# Altium project PCB_Project_STM32_F103.PrjPcb
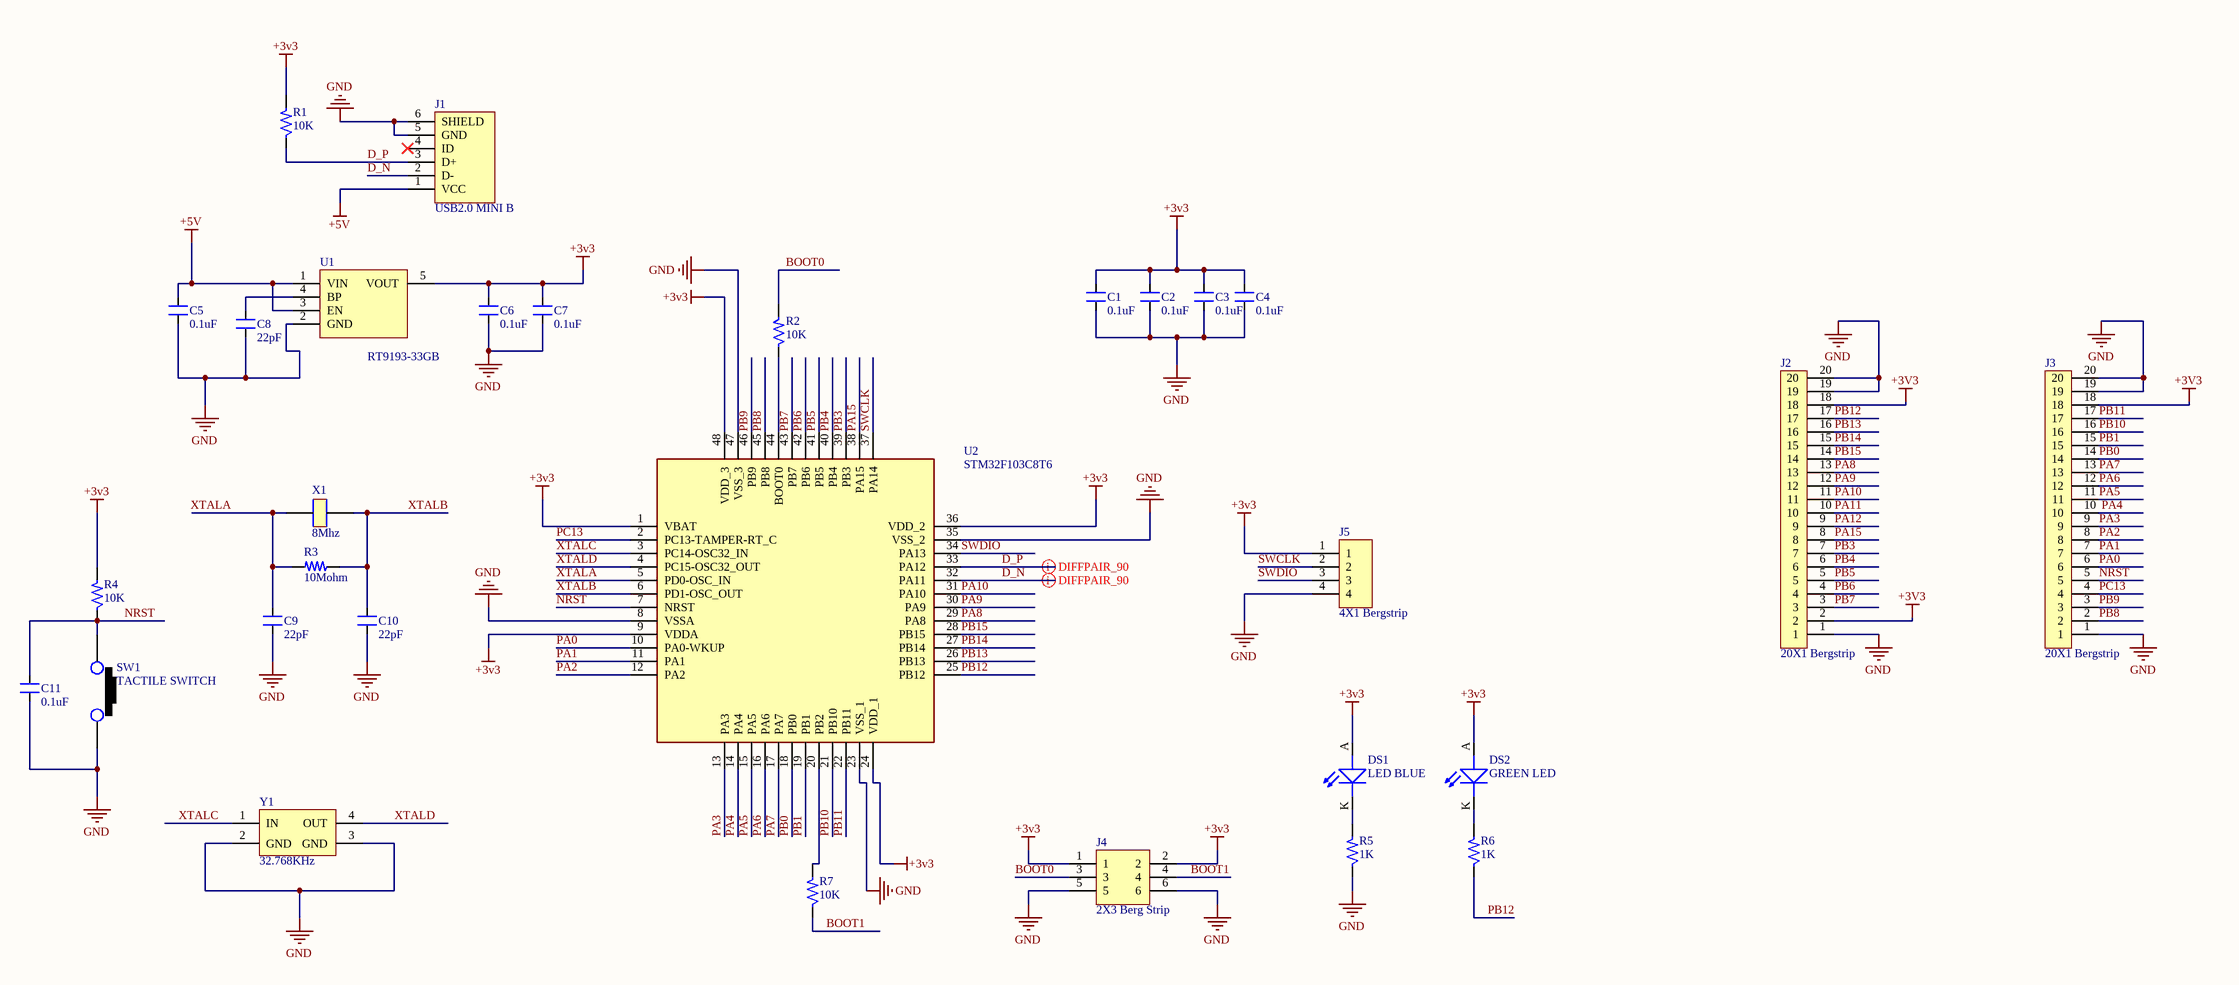
[diagram p0: stm32f103.SchDoc]
1 sheet, 30 parts. Net scope: global (net labels, ports and power ports of the same name join across sheets).
Board file: PCB1.~(37).PcbDoc

## Sheet stm32f103.SchDoc
size C; SheetNumber: 1; SheetTotal: 1

### Parts
C1  0.1uF  [CAP_0805]
C2  0.1uF  [CAP_0805]
C3  0.1uF  [CAP_0805]
C4  0.1uF  [CAP_0805]
C5  0.1uF  [CAP_0805]
C6  0.1uF  [CAP_0805]
C7  0.1uF  [CAP_0805]
C8  22pF  [CAP_0805]
C9  22pF  [CAP_0805]
C10  22pF  [CAP_0805]
C11  0.1uF  [CAP_0805]
DS1  LED BLUE  [LED_0805]
DS2  GREEN LED  [LED_0805]
J1  USB2.0 MINI B  [CON_690-005-299-043]
J2  20X1 Bergstrip  [CON20_100_40D72_TH_ST]
J3  20X1 Bergstrip  [CON20_100_40D72_TH_ST]
J4  2X3 Berg Strip  [CON6_100_59D78_TH_ST_Duplicate]
J5  4X1 Bergstrip  [CON4_100_40D72_TH_ST_MALE]
R1  10K  [RES_0805]
R2  10K  [RES_0805]
R3  10Mohm  [RES_0805]
R4  10K  [RES_0805]
R5  1K  [RES_0805]
R6  1K  [RES_0805]
R7  10K  [RES_0805]
SW1  TACTILE SWITCH  [SW_342_SMD]
U1  RT9193-33GB  [SOT23-5]
U2  STM32F103C8T6  [LQFP-48_19.6_393_58X11_SMD]
X1  8Mhz  [XTAL_314_240X47_SMD]
Y1  32.768KHz  [XTAL_MC-405 32.7680K-G3]

### Nets
+3v3: C1.2 C2.2 C3.2 C4.2 C6.2 C7.2 DS1.A(ANODE) DS2.A(ANODE) J2.2 J2.18 J3.18 J4.1 J4.2 J5.1 R1.2 R4.2 U1.5(VOUT) U2.1(VBAT) U2.9(VDDA) U2.24(VDD_1) U2.36(VDD_2) U2.48(VDD_3)
+5V: C5.2 J1.1(VCC) U1.1(VIN) U1.3(EN)
GND: C1.1 C2.1 C3.1 C4.1 C5.1 C6.1 C7.1 C8.1 C9.1 C10.1 C11.1 J1.5(GND) J1.6(SHIELD) J2.1 J2.19 J2.20 J3.1 J3.19 J3.20 J4.5 J4.6 J5.4 R5.1 SW1.2 U1.2(GND) U2.8(VSSA) U2.23(VSS_1) U2.35(VSS_2) U2.47(VSS_3) Y1.2(GND) Y1.3(GND)
BOOT0: J4.3 R2.2
BOOT1: J4.4 R7.1
D_N: J1.2(D-) U2.32(PA11)
D_P: J1.3(D+) R1.1 U2.33(PA12)
NRST: C11.2 J3.5 R4.1 SW1.1 U2.7(NRST)
PA0: J3.6 U2.10(PA0-WKUP)
PA1: J3.7 U2.11(PA1)
PA2: J3.8 U2.12(PA2)
PA3: J3.9 U2.13(PA3)
PA4: J3.10 U2.14(PA4)
PA5: J3.11 U2.15(PA5)
PA6: J3.12 U2.16(PA6)
PA7: J3.13 U2.17(PA7)
PA8: J2.13 U2.29(PA8)
PA9: J2.12 U2.30(PA9)
PA10: J2.11 U2.31(PA10)
PA11: J2.10
PA12: J2.9
PA15: J2.8 U2.38(PA15)
PB0: J3.14 U2.18(PB0)
PB1: J3.15 U2.19(PB1)
PB3: J2.7 U2.39(PB3)
PB4: J2.6 U2.40(PB4)
PB5: J2.5 U2.41(PB5)
PB6: J2.4 U2.42(PB6)
PB7: J2.3 U2.43(PB7)
PB8: J3.2 U2.45(PB8)
PB9: J3.3 U2.46(PB9)
PB10: J3.16 U2.21(PB10)
PB11: J3.17 U2.22(PB11)
PB12: J2.17 R6.1 U2.25(PB12)
PB13: J2.16 U2.26(PB13)
PB14: J2.15 U2.27(PB14)
PB15: J2.14 U2.28(PB15)
PC13: J3.4 U2.2(PC13-TAMPER-RT_C)
SWCLK: J5.2 U2.37(PA14)
SWDIO: J5.3 U2.34(PA13)
XTALA: C9.2 R3.1 U2.5(PD0-OSC_IN) X1.1
XTALB: C10.2 R3.2 U2.6(PD1-OSC_OUT) X1.2
XTALC: U2.3(PC14-OSC32_IN) Y1.1(IN)
XTALD: U2.4(PC15-OSC32_OUT) Y1.4(OUT)
NetC8_2: C8.2 U1.4(BP)
NetDS1_K: DS1.K(CATHODE) R5.2
NetDS2_K: DS2.K(CATHODE) R6.2
NetR2_1: R2.1 U2.44(BOOT0)
NetR7_2: R7.2 U2.20(PB2)

Not connected (* = marked no-connect by the designer): J1 4(ID)*

### Layout directives
differential pair; differential pair class diff_90: D_N, D_P

### Library data of the parts
C1-C7 C11 = CAP_0.1uF-50V-5%-0805: 0.1µF ±5% 50V Ceramic Capacitor X7R 0805 (2012 Metric); Manufacturer: AVX Corporation; Manufacturer Part Number: 08055C104JAT4A; Alternate Part Number-1: 0805B104M500; Case/Package: 0805; Supplier-1: SIRICOM; Supplier Part Number-1: 0805B104J500CT
C8-C10 = CAP_22PF-50V-5%-0805: 22pF ±5% 50V Ceramic Capacitor C0G, NP0 0805 (2012 Metric); Manufacturer: Yageo; Manufacturer Part Number: CC0805JRNPO9BN220; Alternate Part Number-1: 0805CG220J500NT; Case/Package: 0805; Supplier-1: SIRICOM; Supplier Part Number-1: 0805N220J500CT
DS1 = LED_BLUE-3V3-20mA-0805: Blue 470nm LED Indication - Discrete 3.3V 0805 (2012 Metric); Manufacturer: Vishay Lite-On; Manufacturer Part Number: LTST-C171TBKT; Alternate Part Number-1: NA; Case/Package: 0805; Supplier-1: SP ROAD; Supplier Part Number-1: LTST-C171TBKT
DS2 = LED_GREEN-2.2-20mA-0805: Green 569nm LED Indication - Discrete 2.1V 0805 (2012 Metric); Manufacturer: Vishay Lite-On; Manufacturer Part Number: LTST-C171GKT; Alternate Part Number-1: NA; Case/Package: 0805; Supplier-1: SP ROAD; Supplier Part Number-1: LTST-C171GKT
J1 = CON_USB2.0-MINIB-SMD: USB - mini B USB 2.0 Receptacle Connector 5 Position Surface Mount, Right Angle; Manufacturer: EDAC; Manufacturer Part Number: 690-005-299-043; Alternate Part Number-1: NA; Case/Package: USB-MINI-B; Supplier-1: LCSC; Supplier Part Number-1: C105424
J2 J3 = CON-BS-PLG_20X1-100-TH-ST: 20 pin, 1 row, 2.54mm pitch bergstrip; Manufacturer: NA; Manufacturing Part Number: NA; Case/Package: TH; Supplier-1: NA; Supplier Part Number-1: NA
J4 = CON-BS-PLG_2X3-100-TH-ST: 6 pin, 2 row, 2.54mm pitch bergstrip; Manufacturer: NA; Manufacturer Part Number: NA; Case/Package: TH; Supplier-1: NA; Supplier Part Number-1: NA
J5 = CON-BS-PLG_4X1-100-TH-ST: 4 pin, 1 row, 2.54mm pitch bergstrip; Manufacturer: NA; Manufacturing Part Number: NA; Case/Package: TH; Supplier-1: NA; Supplier Part Number-1: NA
R1 R2 R4 R7 = RES_10K-0.125W-1%-0805: 10 kOhms ±1% 0.125W, 1/8W Chip Resistor 0805 (2012 Metric) Automotive AEC-Q200 Thick Film; Manufacturer: CTS; Manufacturer Part Number: WR08X1002FTL; Case/Package: 0805; Supplier-1: SIRICOM; Supplier Part Number-1: WR08X1002FTL; Alternate Part Number-1: WR08X1002FTL
R3 = RES_10MOHM-0.125W-1%-0805: 10 MOhms ±1% 0.125W, 1/8W Chip Resistor 0805 (2012 Metric) Automotive AEC-Q200, High Voltage Thick Film; Manufacturer: Rohm Semiconductor; Manufacturing Part Number: KTR10EZPF1005; Case/Package: 0805 (2012 Metric); Supplier-1: Digikey; Supplier Part Number-1: RHM10.0MAHCT-ND
R5 R6 = RES_1K-0.125W-1%-0805: 1 kOhms ±1% 0.125W, 1/8W Chip Resistor 0805 (2012 Metric) Moisture Resistant Thick Film; Manufacturer: Walsin; Manufacturer Part Number: WR08X1001FTL; Case/Package: 0805; Supplier-1: SP ROAD; Supplier Part Number-1: RC0805JR-071KL; Alternate Part Number-1: WR08X1001FTL
SW1 = SW1_RS-282G05A3-SMRT-SMD: Tactile Switch SPST-NO Top Actuated Surface Mount; Manufacturer: ITT C&K; Alternate Part Number-1: NA; Manufacturer Part Number: RS-282G05A3-SMRT; Case/Package: SMD; Supplier-1: SP ROAD; Supplier Part Number-1: RS-282G05A3-SMRT
U1 = REG_5.5V-3.3V-0.3A-1W-SOT-23-5: Linear Voltage Regulator IC 1 Output 300mA SOT-23-5; Manufacturer: Richtek USA Inc.; Alternate Part Number-1: NA; Manufacturer Part Number: RT9193-33GB; Supplier-1: LCSC; Supplier Part Number-1: C15651; Case/Package: SOT-23-5
U2 = IC_STM32F103C8T6: ARM® Cortex®-M3 STM32F1 Microcontroller IC 32-Bit 72MHz 64KB (64K x 8) FLASH 48-LQFP (7x7); Manufacturer: STMicroelectronics; Alternate Part Number-1: NA; Manufacturer Part Number: STM32F103C8T6; Case/Package: LQFP48; Supplier-1: LCSC; Supplier Part Number-1: STM32F103C8T6
X1 = XTAL_8MHZ-ECS-80-32-5PX-SMD: 8MHz ±30ppm Crystal 32pF 60 Ohms HC-49/US; Manufacturer: Fox Electronics; Manufacturer Part Number: ECS-80-32-5PX-TR; Alternate Part Number-1: NA; Case/Package: SMD/SMT; Supplier-1: SP ROAD; Supplier Part Number-1: ECS-80-32-5PX-TR
Y1 = XTAL_32.768KHz-MC-405 32.7680K-G3: Crystals SMD AT XTL MHZ +/-50PPM 12.5 PF 250 T/R; Manufacturer: Epson; Manufacturing Part Number: MC-405 32.7680K-G3: ROHS; Case/Package: SMD; Supplier-1: Mouser; Supplier Part Number-1: 732-MC405327680KG3RS